# Altium schematic sheet SensWear_Debug_Pico.SchDoc (part 1 of 3)
size A3
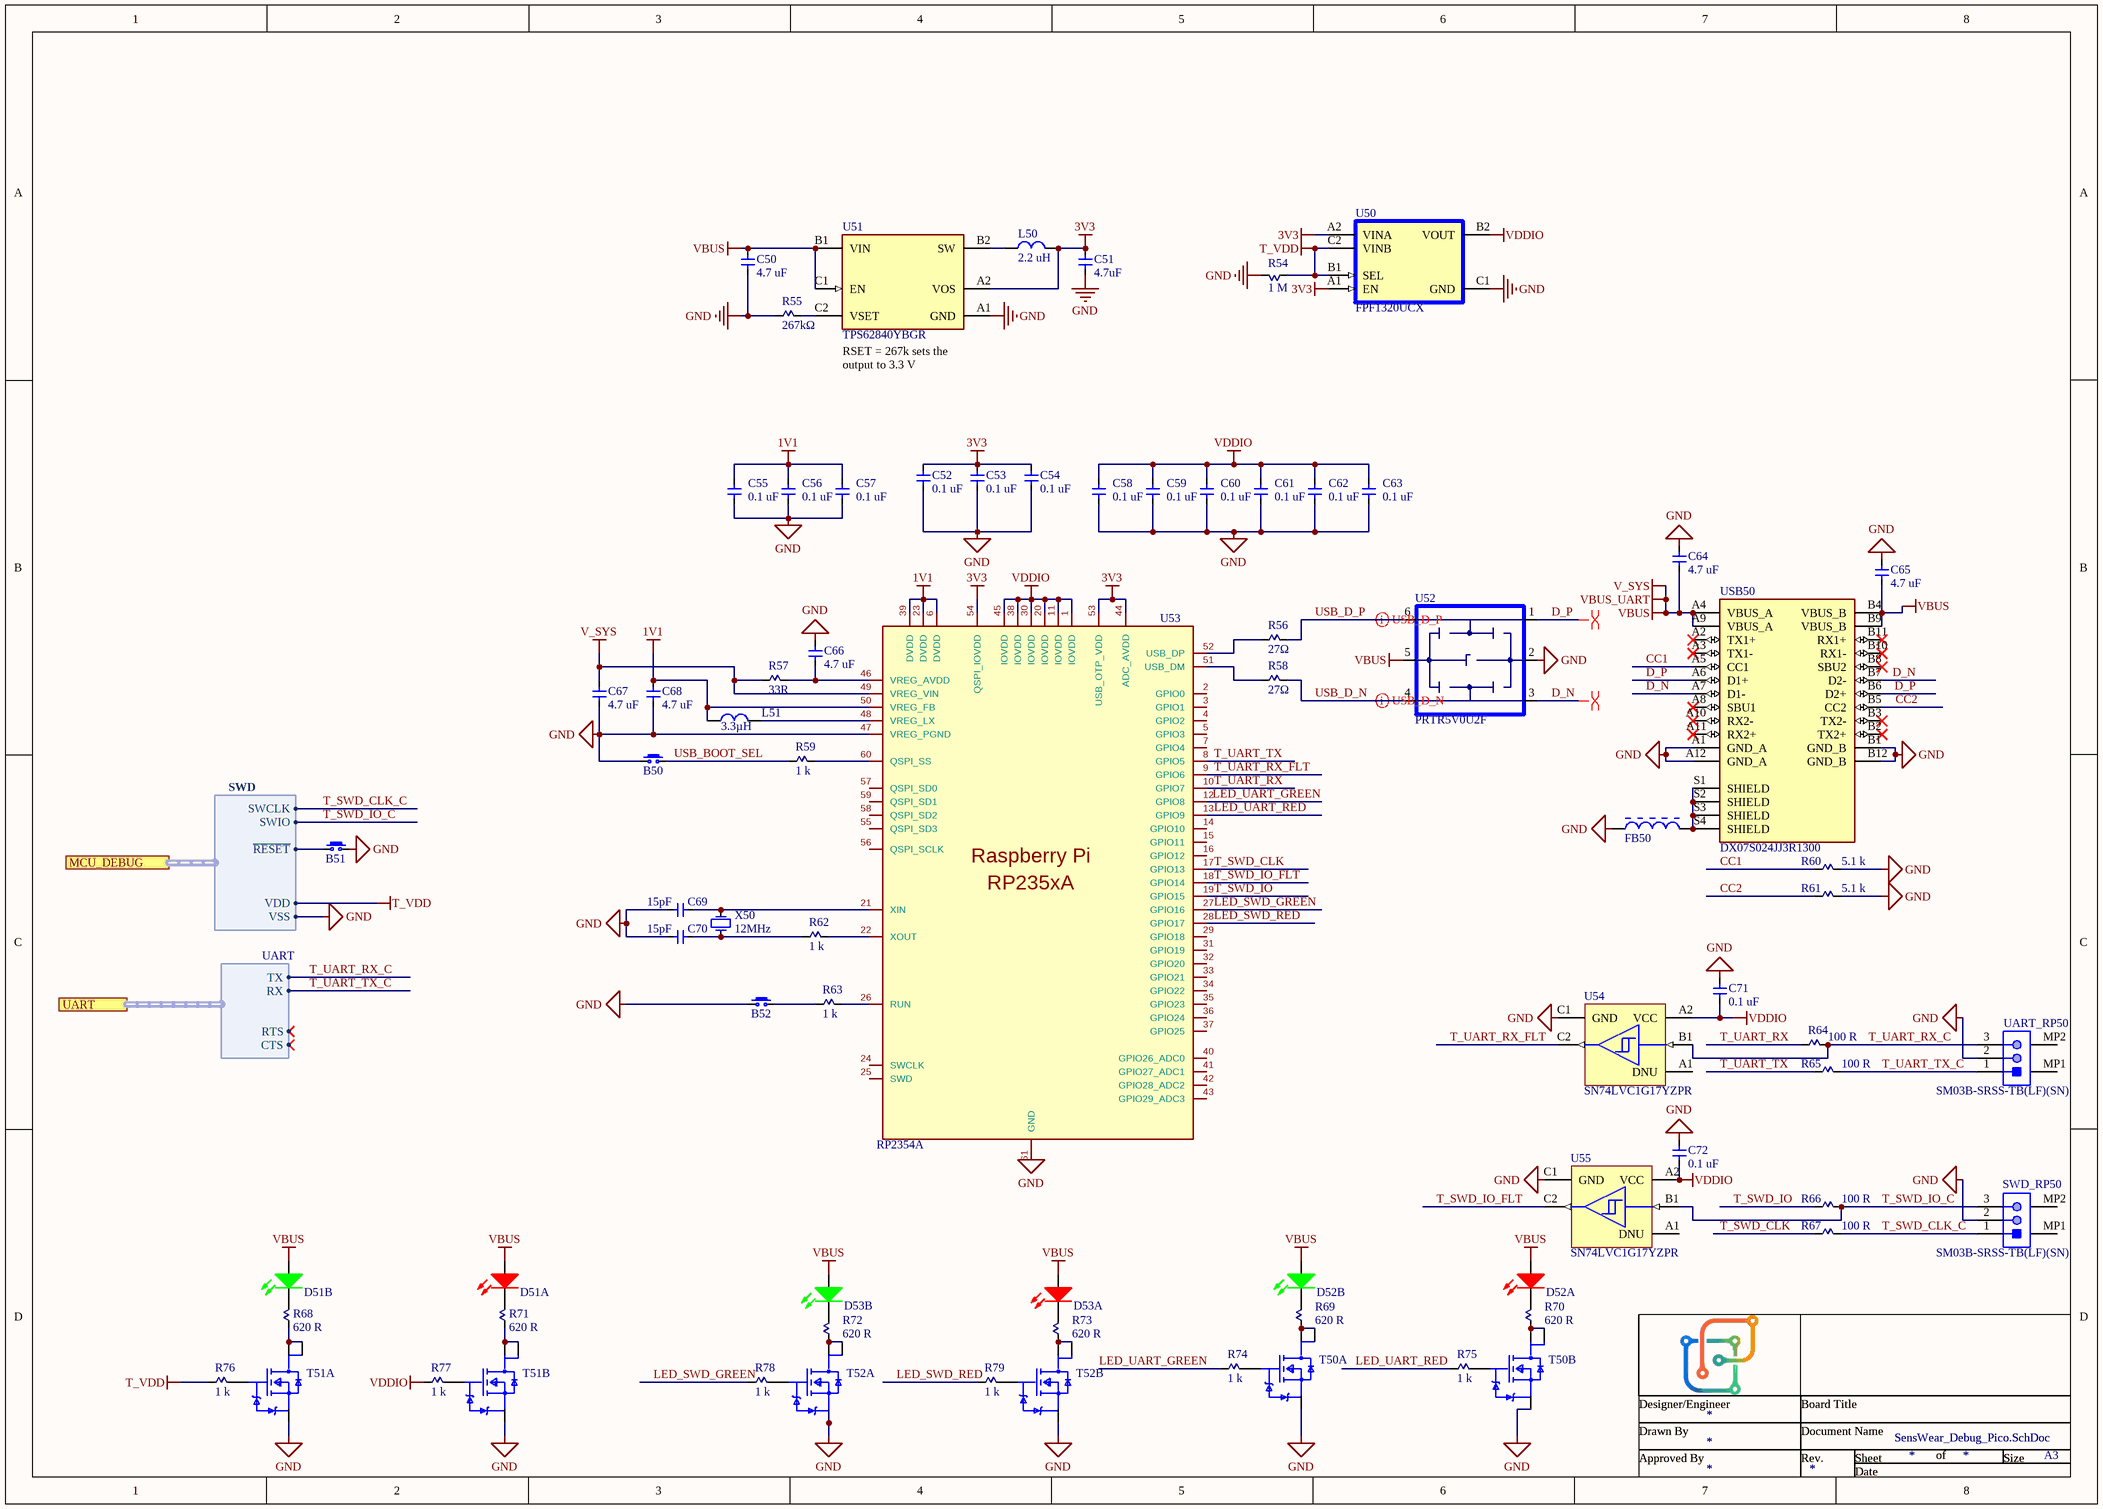
[diagram p0: SensWear_Debug_Pico.SchDoc]

## Parts
B50  B3U-1000P  [B3U-1000P]  (value not drawn)
B51  B3U-1000P  [B3U-1000P]  (value not drawn)
B52  B3U-1000P  [B3U-1000P]  (value not drawn)
C50  4.7 uF  [CAPC1610X05N]
C51  4.7uF  [CAPC1005X05N]
C52  0.1 uF  [CAPC1005X05N]
C53  0.1 uF  [CAPC1005X05N]
C54  0.1 uF  [CAPC1005X05N]
C55  0.1 uF  [CAPC1005X05N]
C56  0.1 uF  [CAPC1005X05N]
C57  0.1 uF  [CAPC1005X05N]
C58  0.1 uF  [CAPC1005X05N]
C59  0.1 uF  [CAPC1005X05N]
C60  0.1 uF  [CAPC1005X05N]
C61  0.1 uF  [CAPC1005X05N]
C62  0.1 uF  [CAPC1005X05N]
C63  0.1 uF  [CAPC1005X05N]
C64  4.7 uF  [CAPC1610X05N]
C65  4.7 uF  [CAPC1610X05N]
C66  4.7 uF  [CAPC1610X05N]
C67  4.7 uF  [CAPC1610X05N]
C68  4.7 uF  [CAPC1610X05N]
C69  15pF  [CAPC1005X05N]
C70  15pF  [CAPC1005X05N]
C71  0.1 uF  [CAPC1005X05N]
C72  0.1 uF  [CAPC1005X05N]
D51  LTST-C155KGJRKT  [LTST-C155KGJRKT]  (value not drawn)  (parts A,B of 2)
D52  LTST-C155KGJRKT  [LTST-C155KGJRKT]  (value not drawn)  (parts A,B of 2)
D53  LTST-C155KGJRKT  [LTST-C155KGJRKT]  (value not drawn)  (parts A,B of 2)
FB50  BLM15AG601SN1D  [MURA-BLM15-CHIP-2_V]  (value not drawn)
L50  2.2 uH  [FP-DFE201612C-MFG]
L51  3.3µH  [AOTAB201610S3R3101T]
R54  1 M  [RESC1005X04N]
R55  267kΩ  [RESC1005X04N]
R56  27Ω  [RESC1005X04N]
R57  33R  [RESC1005X04N]
R58  27Ω  [RESC1005X04N]
R59  1 k  [RESC1005X04N]
R60  5.1 k  [RESC1005X04N]
R61  5.1 k  [RESC1005X04N]
R62  1 k  [RESC1005X04N]
R63  1 k  [RESC1005X04N]
R64  100 R  [RESC1005X04N]
R65  100 R  [RESC1005X04N]
R66  100 R  [RESC1005X04N]
R67  100 R  [RESC1005X04N]
R68  620 R  [RESC1005X04N]
R69  620 R  [RESC1005X04N]
R70  620 R  [RESC1005X04N]
R71  620 R  [RESC1005X04N]
R72  620 R  [RESC1005X04N]
R73  620 R  [RESC1005X04N]
R74  1 k  [RESC1005X04N]
R75  1 k  [RESC1005X04N]
R76  1 k  [RESC1005X04N]
R77  1 k  [RESC1005X04N]
R78  1 k  [RESC1005X04N]
R79  1 k  [RESC1005X04N]
SWD_RP50  SM03B-SRSS-TB(LF)(SN)  [JST-SM03B-SRSS-TB_V]
T50  CSD87502Q2  [FP-DQK0006B-MFG]  (value not drawn)  (parts A,B of 2)
T51  CSD87502Q2  [FP-DQK0006B-MFG]  (value not drawn)  (parts A,B of 2)
T52  CSD87502Q2  [FP-DQK0006B-MFG]  (value not drawn)  (parts A,B of 2)
U50  FPF1320UCX  [BGA6C50P2X3_96X146X62]
U51  TPS62840YBGR  [BGA6C40P2X3_97X147X50]
U52  PRTR5V0U2F  [SON50P100X50-6N]
U53  RP2354A  [QFN40P700X700X90_HS-61N]
U54  SN74LVC1G17YZPR  [YZP0005ADAD]
U55  SN74LVC1G17YZPR  [YZP0005ADAD]
UART_RP50  SM03B-SRSS-TB(LF)(SN)  [JST-SM03B-SRSS-TB_V]
USB50  DX07S024JJ3R1300  [JAE-DX07S024JJ3R1300-MFG]
X50  12MHz  [DFN165P250X80-4N]

## Ports
MCU_DEBUG (harness SWD), UART (harness UART)

## Harnesses
UART: TX, RX, RTS, CTS
SWD: SWCLK, SWIO, ~{RESET}, VDD, VSS

## Nets
1V1: C55.1 C56.1 C57.1 C68.2 L51.1 U53.6(DVDD) U53.23(DVDD) U53.39(DVDD) U53.50(VREG_FB)
3V3: C51.1 C52.2 C53.2 C54.2 L50.2 U50.A1(EN) U50.A2(VINA) U51.A2(VOS) U53.44(ADC_AVDD) U53.53(USB_OTP_VDD) U53.54(QSPI_IOVDD)
GND: B50.1 B51.1 B52.1 C50.1 C51.2 C52.1 C53.1 C54.1 C55.2 C56.2 C57.2 C58.2 C59.2 C60.2 C61.2 C62.2 C63.2 C64.1 C65.1 C66.1 C67.1 C68.1 C69.1 C70.1 C71.2 C72.2 FB50.1 R54.2 R55.1 R60.2 R61.2 SWD_RP50.2 T50.1(S1) T50.4(S2) T51.1(S1) T51.4(S2) T52.1(S1) T52.4(S2) U50.C1(GND) U51.A1(GND) U52.2 U53.47(VREG_PGND) U53.61(GND) U54.C1(GND) U55.C1(GND) UART_RP50.2 USB50.A1(GND_A) USB50.A12(GND_A) USB50.B1(GND_B) USB50.B12(GND_B) X50.2(GND) X50.4(GND) ; port MCU_DEBUG.VSS
T_VDD: R54.1 R76.1 U50.B1(SEL) U50.C2(VINB) ; port MCU_DEBUG.VDD
V_SYS: C50.2 C64.2 C65.2 C67.2 D51.1(A) D51.2(A) D52.1(A) D52.2(A) D53.1(A) D53.2(A) R57.1 U51.B1(VIN) U51.C1(EN) U52.5 U53.49(VREG_VIN) USB50.A4(VBUS_A) USB50.A9(VBUS_A) USB50.B4(VBUS_B) USB50.B9(VBUS_B)  [also labelled VBUS, VBUS_UART]
VDDIO: C58.1 C59.1 C60.1 C61.1 C62.1 C63.1 C71.1 C72.1 R77.1 U50.B2(VOUT) U53.1(IOVDD) U53.11(IOVDD) U53.20(IOVDD) U53.30(IOVDD) U53.38(IOVDD) U53.45(IOVDD) U54.A2(VCC) U55.A2(VCC)
CC1: R60.1 USB50.A5(CC1)
CC2: R61.1 USB50.B5(CC2)
D_N: U52.3 USB50.A7(D1-) USB50.B7(D2-)
D_P: U52.1 USB50.A6(D1+) USB50.B6(D2+)
LED_SWD_GREEN: R78.1 U53.27(GPIO16)
LED_SWD_RED: R79.1 U53.28(GPIO17)
LED_UART_GREEN: R74.1 U53.12(GPIO8)
LED_UART_RED: R75.1 U53.13(GPIO9)
T_SWD_CLK: R67.2 U53.17(GPIO13)
T_SWD_CLK_C: R67.1 SWD_RP50.1 ; port MCU_DEBUG.SWCLK
T_SWD_IO: R66.2 U53.19(GPIO15)
T_SWD_IO_C: R66.1 SWD_RP50.3 U55.B1(A) ; port MCU_DEBUG.SWIO
T_SWD_IO_FLT: U53.18(GPIO14) U55.C2(Y)
T_UART_RX: R64.2 U53.10(GPIO7)
T_UART_RX_C: R64.1 U54.B1(A) UART_RP50.3 ; port UART.TX
T_UART_RX_FLT: U53.9(GPIO6) U54.C2(Y)
T_UART_TX: R65.2 U53.8(GPIO5)
T_UART_TX_C: R65.1 UART_RP50.1 ; port UART.RX
USB_BOOT_SEL: B50.2 R59.1
USB_D_N: R58.2 U52.4
USB_D_P: R56.2 U52.6
NetB51_2: B51.2 ; port MCU_DEBUG.~{RESET}
NetB52_2: B52.2 R63.1
NetC66_2: C66.2 R57.2 U53.46(VREG_AVDD)
NetC69_2: C69.2 U53.21(XIN) X50.3(OSC2)
NetC70_2: C70.2 R62.1 X50.1(OSC1)
NetD51_3: D51.3(K) R68.2
NetD51_4: D51.4(K) R71.2
NetD52_3: D52.3(K) R69.2
NetD52_4: D52.4(K) R70.2
NetD53_3: D53.3(K) R72.2
NetD53_4: D53.4(K) R73.2
NetFB50_2: FB50.2 USB50.S1(SHIELD) USB50.S2(SHIELD) USB50.S3(SHIELD) USB50.S4(SHIELD)
NetL50_1: L50.1 U51.B2(SW)
NetL51_2: L51.2 U53.48(VREG_LX)
NetR55_2: R55.2 U51.C2(VSET)
NetR56_1: R56.1 U53.52(USB_DP)
NetR58_1: R58.1 U53.51(USB_DM)
NetR59_2: R59.2 U53.60(QSPI_SS)
NetR62_2: R62.2 U53.22(XOUT)
NetR63_2: R63.2 U53.26(RUN)
NetR68_1: R68.1 T51.6(D1) T51.7(D1)
NetR69_1: R69.1 T50.6(D1) T50.7(D1)
NetR70_1: R70.1 T50.3(D2) T50.8(D2)
NetR71_1: R71.1 T51.3(D2) T51.8(D2)
NetR72_1: R72.1 T52.6(D1) T52.7(D1)
NetR73_1: R73.1 T52.3(D2) T52.8(D2)
NetR74_2: R74.2 T50.2(G1)
NetR75_2: R75.2 T50.5(G2)
NetR76_2: R76.2 T51.2(G1)
NetR77_2: R77.2 T51.5(G2)
NetR78_2: R78.2 T52.2(G1)
NetR79_2: R79.2 T52.5(G2)

Not connected (* = marked no-connect by the designer): SWD_RP50 MP1 MP2; U53 2(GPIO0) 3(GPIO1) 4(GPIO2) 5(GPIO3) 7(GPIO4) 14(GPIO10) 15(GPIO11) 16(GPIO12) 24(SWCLK) 25(SWD) 29(GPIO18) 31(GPIO19) 32(GPIO20) 33(GPIO21) 34(GPIO22) 35(GPIO23) 36(GPIO24) 37(GPIO25) 40(GPIO26_ADC0) 41(GPIO27_ADC1) 42(GPIO28_ADC2) 43(GPIO29_ADC3) 55(QSPI_SD3) 56(QSPI_SCLK) 57(QSPI_SD0) 58(QSPI_SD2) 59(QSPI_SD1); U54 A1(DNU); U55 A1(DNU); UART_RP50 MP1 MP2; USB50 A2(TX1+)* A3(TX1-)* A8(SBU1)* A10(RX2-)* A11(RX2+)* B2(TX2+)* B3(TX2-)* B8(SBU2)* B10(RX1-)* B11(RX1+)*

## Layout directives
differential pair: D_N, D_P, USB_D_N, USB_D_P

## Notes on the sheet
- (near U51) RSET = 267k sets the output to 3.3 V
- Designer/Engineer
- Drawn By
- Document Name
- Board Title
- Sheet
- of
- Size
- A3
- Approved By
- Rev.
- Date
- (in symbol RP2354A) Raspberry Pi; RP235xA